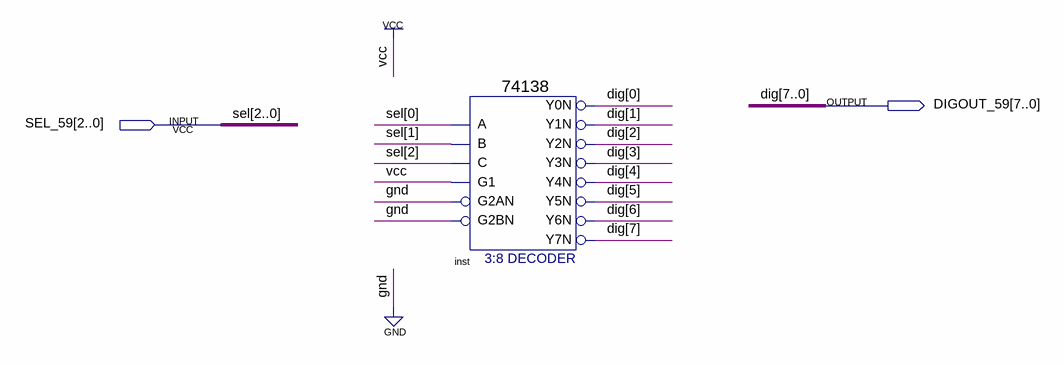
[diagram p0: schematic sheet]
// Quartus schematic digsel_59.bdf as structural Verilog: 1 symbols, 2 pins
module digsel_59 (
  input  [2:0] SEL_59,
  output [7:0] DIGOUT_59
);

  \74138  inst (
    .A(SEL_59[0]), .B(SEL_59[1]), .G1(1'b1), .C(SEL_59[2]), .G2AN(1'b0), .G2BN(1'b0), .Y0N(DIGOUT_59[0]),
    .Y1N(DIGOUT_59[1]), .Y2N(DIGOUT_59[2]), .Y3N(DIGOUT_59[3]), .Y4N(DIGOUT_59[4]), .Y5N(DIGOUT_59[5]),
    .Y6N(DIGOUT_59[6]), .Y7N(DIGOUT_59[7]));

  // Other names for the same wires on the sheet: dig[7:0] = DIGOUT_59; sel[2:0] = SEL_59
endmodule
